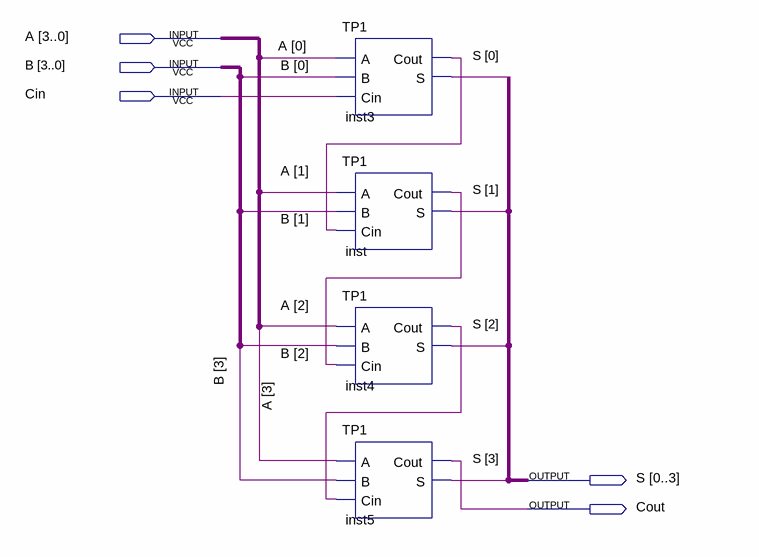
[diagram p0: schematic sheet]
// Quartus schematic Block1.bdf as structural Verilog: 4 symbols, 5 pins
module Block1 (
  input  [3:0] A,
  input  [3:0] B,
  input  Cin,
  output [0:3] S,
  output Cout
);

  wire inst3_cout, inst4_cout, inst_cout;

  TP1 inst3 (.A(A[0]), .B(B[0]), .Cin(Cin), .Cout(inst3_cout), .S(S[0]));
  TP1 inst (.A(A[1]), .B(B[1]), .Cin(inst3_cout), .Cout(inst_cout), .S(S[1]));
  TP1 inst4 (.A(A[2]), .B(B[2]), .Cin(inst_cout), .Cout(inst4_cout), .S(S[2]));
  TP1 inst5 (.A(A[3]), .B(B[3]), .Cin(inst4_cout), .Cout(Cout), .S(S[3]));
endmodule
